# Altium schematic sheet Corporate LED.SchDoc
size A
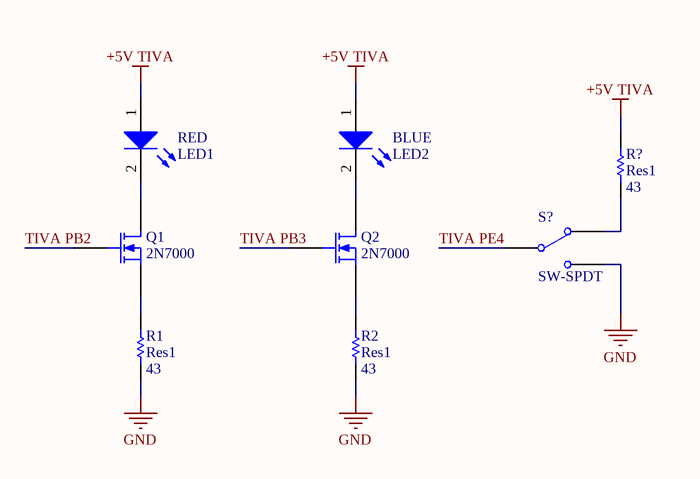
[diagram p0: Corporate LED.SchDoc]

## Parts
BLUE  LED2  [LED-1]
Q1  2N7000  [BCY-W3/D5]
Q2  2N7000  [BCY-W3/D5]
R1  Res1  value 43  [AXIAL-0.3]
R2  Res1  value 43  [AXIAL-0.3]
R?  Res1  value 43  [AXIAL-0.3]
RED  LED1  [LED-1]
S?  SW-SPDT  [SPDT-3]

## Nets
+5V TIVA: BLUE.1(A) R?.2 RED.1(A)
GND: R1.1 R2.1 S?.3(NO)
TIVA PB2: Q1.2(G)
TIVA PB3: Q2.2(G)
TIVA PE4: S?.1(COMMON)
NetBLUE_2: BLUE.2(K) Q2.3(D)
NetQ1_1: Q1.1(S) R1.2
NetQ1_3: Q1.3(D) RED.2(K)
NetQ2_1: Q2.1(S) R2.2
NetR?_1: R?.1 S?.2(NC)

## Library data of the parts
BLUE RED = LED1: Typical RED GaAs LED; Manufacturer: Generic Components; Class: Optoelectronic; Published: 08/06/2000; Publisher: Altium Hobart Technology Centre; SubClass: LED
Q1 Q2 = 2N7000: N-Channel Enhancement Mode Vertical DMOS FET; Manufacturer: Zetex; Class: Discrete; SubClass: MOSFET - Low Power; Published: 8/06/2000; Publisher: Altium Hobart Technology Centre
R1 R2 R? = Res1: Resistor; Manufacturer: Generic Components; Class: Passive; Published: 08/06/2000; Publisher: Altium Hobart Technology Centre; SubClass: Resistor
S? = SW-SPDT: Single-Pole, Double-Throw Switch; Manufacturer: Generic Components; Published: 1999